# EAGLE schematic LSPSM (EAGLE 6.5.0)

## Sheet 1 of 4
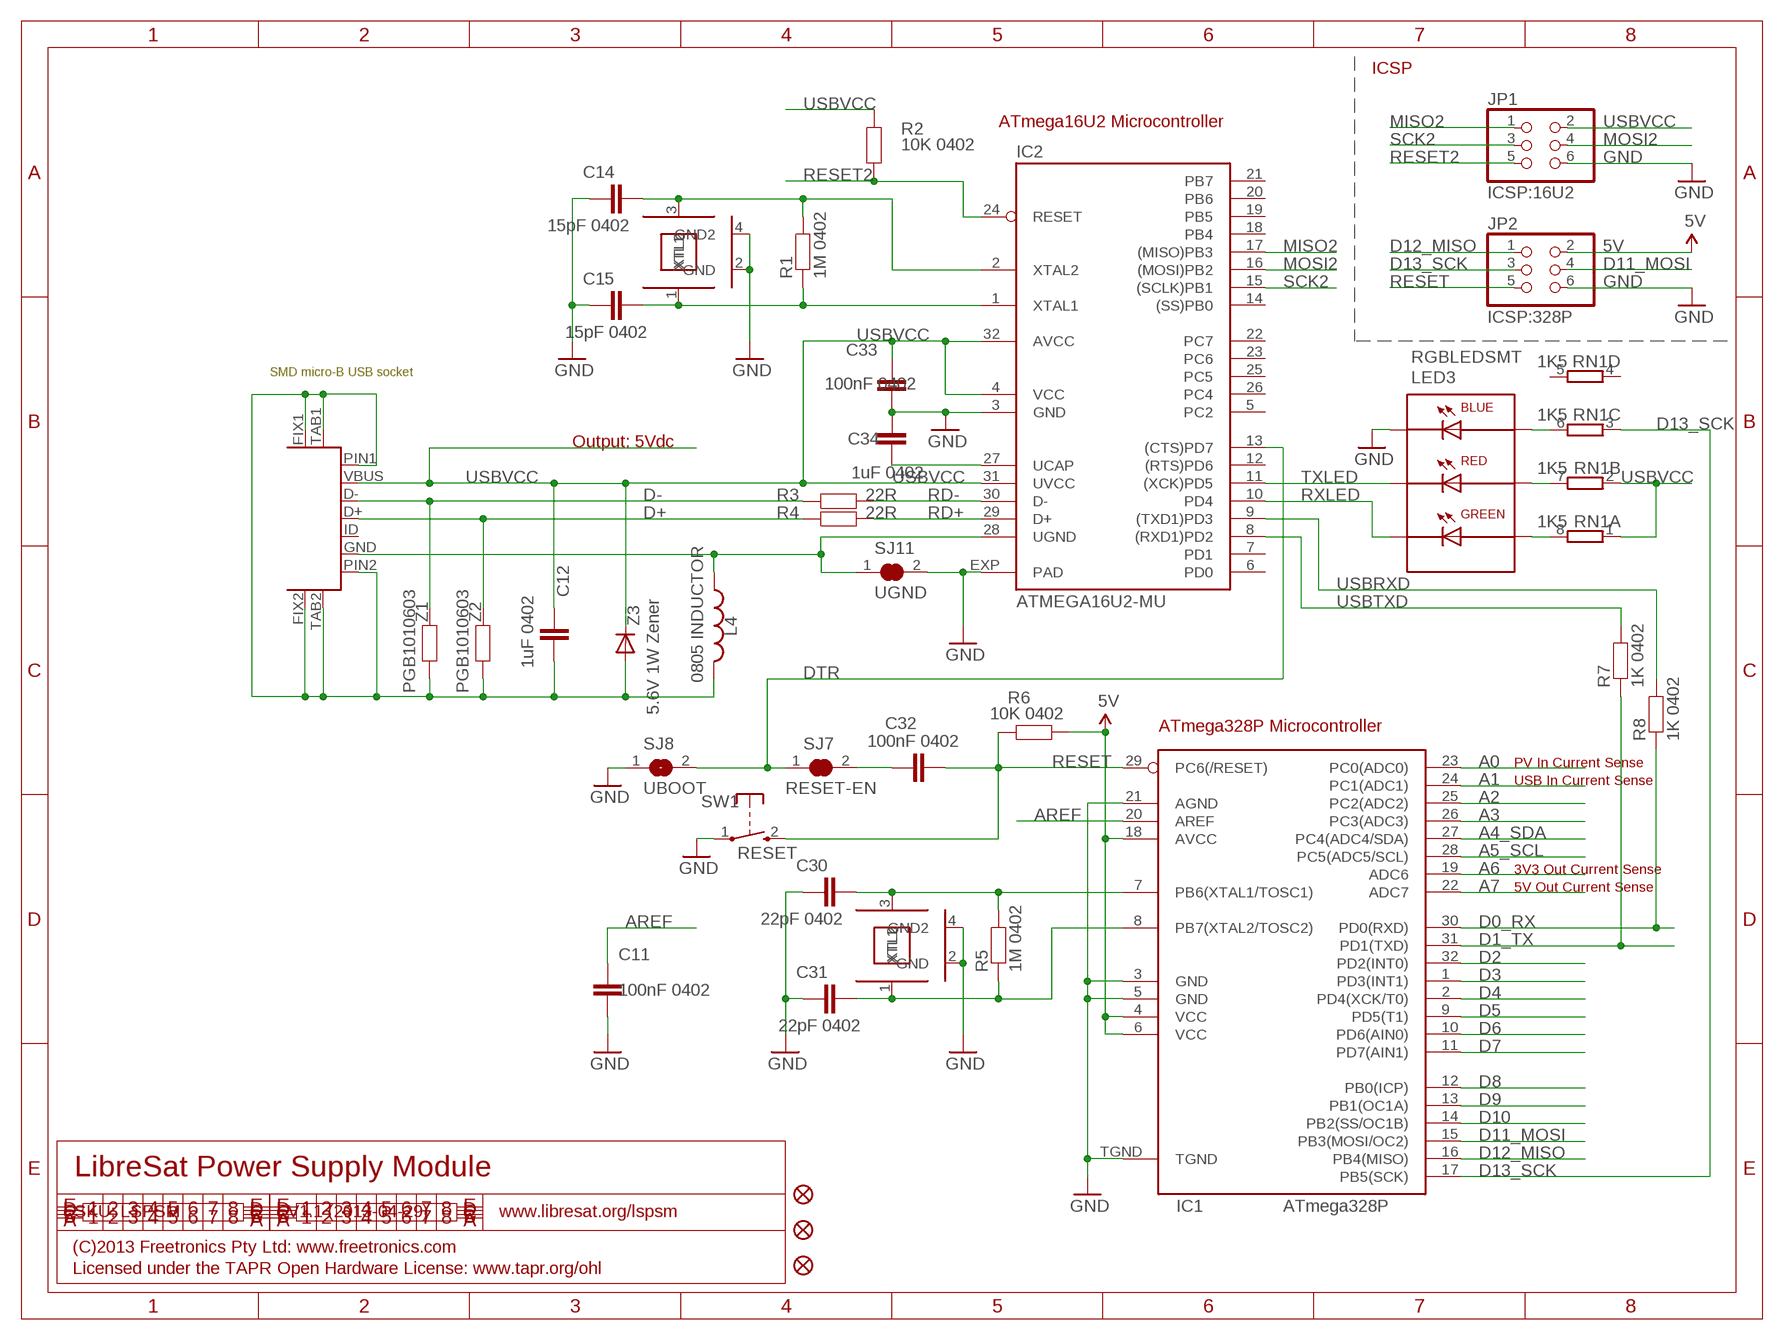
[diagram p0: schematic, sheet 1]

### Parts
C11  100nF 0402  C-EU0402C  [0402C]
C12  1uF 0402  C-EU0402C  [0402C]
C14  15pF 0402  C-EU0402C  [0402C]
C15  15pF 0402  C-EU0402C  [0402C]
C30  22pF 0402  C-EU0402C  [0402C]
C31  22pF 0402  C-EU0402C  [0402C]
C32  100nF 0402  C-EU0402C  [0402C]
C33  100nF 0402  C-EU0402C  [0402C]
C34  1uF 0402  C-EU0402C  [0402C]
FID1  FIDUCIAL1X2.5  [FIDUCIAL-1X2.5]
FID2  FIDUCIAL1X2.5  [FIDUCIAL-1X2.5]
FID3  FIDUCIAL1X2.5  [FIDUCIAL-1X2.5]
IC1  ATmega328P  AVR-MEGA8-MI  [MLF32]
IC2  ATMEGA16U2-MU  ATMEL_ATMEGA8U2-MUQFN  [ATMEL_QFN32]
JP1  ICSP:16U2  PINHD-2X3  [2X03]
JP2  ICSP:328P  PINHD-2X3  [2X03]
L4  0805 INDUCTOR  INDUCTOR0805-LARGE  [0805-LARGE]
LED3  RGBLEDSMT  [19-337]
R1  1M 0402  RESISTOR0402  [0402]
R2  10K 0402  RESISTOR0402  [0402]
R3  22R  RESISTOR0402  [0402]
R4  22R  RESISTOR0402  [0402]
R5  1M 0402  RESISTOR0402  [0402]
R6  10K 0402  RESISTOR0402  [0402]
R7  1K 0402  RESISTOR0402  [0402]
R8  1K 0402  RESISTOR0402  [0402]
RN1  1K5  4R-NCAY16  [CAY16]
S1  USB-6PSMT  [USB-MICROB-MB05PMXX]
SJ7  RESET-EN  SJC0402  [0402SJC]
SJ8  UBOOT  SJ0402O  [0402SJO]
SJ11  UGND  SJC0402  [0402SJC]
SW1  RESET  TAC_SWITCH_2PIN  [TACTILE_SWITCH_SMD_2PIN_TINY]
XTL1  16MHz  CRYSTAL-GND3X2  [CRYSTAL-SMD-3X2]
XTL2  16MHz  CRYSTAL-GND3X2  [CRYSTAL-SMD-3X2]
Z1  PGB1010603  RESISTOR0603  [0603]
Z2  PGB1010603  RESISTOR0603  [0603]
Z3  5.6V 1W Zener  DIODESMA  [SMA-DIODE]

### Nets
5V: IC1.4(VCC) IC1.6(VCC) IC1.18(AVCC) JP2.2 R6.2 ; also sheet 2,4
A0: IC1.23(PC0(ADC0)) ; also sheet 2,3
A1: IC1.24(PC1(ADC1)) ; also sheet 2,3
A2: IC1.25(PC2(ADC2)) ; also sheet 2
A3: IC1.26(PC3(ADC3)) ; also sheet 2
A4_SDA: IC1.27(PC4(ADC4/SDA)) ; also sheet 2
A5_SCL: IC1.28(PC5(ADC5/SCL)) ; also sheet 2
A6: IC1.19(ADC6) ; also sheet 2,4
A7: IC1.22(ADC7) ; also sheet 2,4
AREF: C11.1 IC1.20(AREF) ; also sheet 2
D0_RX: IC1.30(PD0(RXD)) R8.1 ; also sheet 2
D1_TX: IC1.31(PD1(TXD)) R7.1 ; also sheet 2
D2: IC1.32(PD2(INT0)) ; also sheet 2
D3: IC1.1(PD3(INT1)) ; also sheet 2
D4: IC1.2(PD4(XCK/T0)) ; also sheet 2
D5: IC1.9(PD5(T1)) ; also sheet 2
D6: IC1.10(PD6(AIN0)) ; also sheet 2
D7: IC1.11(PD7(AIN1)) ; also sheet 2
D8: IC1.12(PB0(ICP)) ; also sheet 2
D9: IC1.13(PB1(OC1A)) ; also sheet 2
D10: IC1.14(PB2(SS/OC1B)) ; also sheet 2
D11_MOSI: IC1.15(PB3(MOSI/OC2)) JP2.4 ; also sheet 2
D12_MISO: IC1.16(PB4(MISO)) JP2.1 ; also sheet 2
D13_SCK: IC1.17(PB5(SCK)) JP2.3 RN1.3 ; also sheet 2
D+: R4.1 S1.D+ Z2.2
D-: R3.1 S1.D- Z1.2
DTR: IC2.13((CTS)PD7) SJ7.1 SJ8.2
GND: C11.2 C14.1 C15.1 C30.1 C31.1 C33.2 C34.2 IC1.3(GND) IC1.5(GND) IC1.21(AGND) IC1.TGND IC2.3(GND) IC2.EXP(PAD) JP1.6 JP2.6 LED3.1(C-B) SJ8.1 SJ11.2 SW1.1(P) XTL1.2(GND) XTL1.4(GND2) XTL2.2(GND) XTL2.4(GND2) ; also sheet 2,3,4
MISO2: IC2.17((MISO)PB3) JP1.1
MOSI2: IC2.16((MOSI)PB2) JP1.4
N$10: C30.2 IC1.7(PB6(XTAL1/TOSC1)) R5.2 XTL2.3(XTL2)
N$12: C15.2 IC2.1(XTAL1) R1.1 XTL1.1(XTL1)
N$14: LED3.4(A-B) RN1.6
N$16: LED3.5(A-R) RN1.7
N$17: LED3.6(A-G) RN1.8
N$24: C31.2 IC1.8(PB7(XTAL2/TOSC2)) R5.1 XTL2.1(XTL1)
N$34: C34.1 IC2.27(UCAP)
N$38: C12.2 L4.2 S1.FIX1 S1.FIX2 S1.PIN1 S1.PIN2 S1.TAB1 S1.TAB2 Z1.1 Z2.1 Z3.A
N$52: C14.2 IC2.2(XTAL2) R1.2 XTL1.3(XTL2)
N$56: IC2.28(UGND) L4.1 S1.GND SJ11.1
N$60: C32.1 SJ7.2
RD+: IC2.29(D+) R4.2
RD-: IC2.30(D-) R3.2
RESET: C32.2 IC1.29(PC6(/RESET)) JP2.5 R6.1 SW1.2(S) ; also sheet 2
RESET2: IC2.24(RESET) JP1.5 R2.1
RXLED: IC2.10(PD4) LED3.3(C-G)
SCK2: IC2.15((SCLK)PB1) JP1.3
TXLED: IC2.11((XCK)PD5) LED3.2(C-R)
USBRXD: IC2.9((TXD1)PD3) R8.2
USBTXD: IC2.8((RXD1)PD2) R7.2
USBVCC: C12.1 C33.1 IC2.4(VCC) IC2.31(UVCC) IC2.32(AVCC) JP1.2 R2.2 RN1.1 RN1.2 S1.VBUS Z3.C ; also sheet 3
Unconnected: IC2.5(PC2) IC2.6(PD0) IC2.7(PD1) IC2.12((RTS)PD6) IC2.14((SS)PB0) IC2.18(PB4) IC2.19(PB5) IC2.20(PB6) IC2.21(PB7) IC2.22(PC7) IC2.23(PC6) IC2.25(PC5) IC2.26(PC4) RN1.4 RN1.5 S1.ID

### Notes on the sheet
- ICSP
- ATmega16U2 Microcontroller
- SMD micro-B USB socket
- Output: 5Vdc
- ATmega328P Microcontroller
- PV In Current Sense
- USB In Current Sense
- 3V3 Out Current Sense
- 5V Out Current Sense
- LibreSat Power Supply Module
- SKU: LSPSM | V1.1 (2013-04-29) | www.libresat.org/lspsm
- (C)2013 Freetronics Pty Ltd: www.freetronics.com
- Licensed under the TAPR Open Hardware License: www.tapr.org/ohl

## Sheet 2 of 4
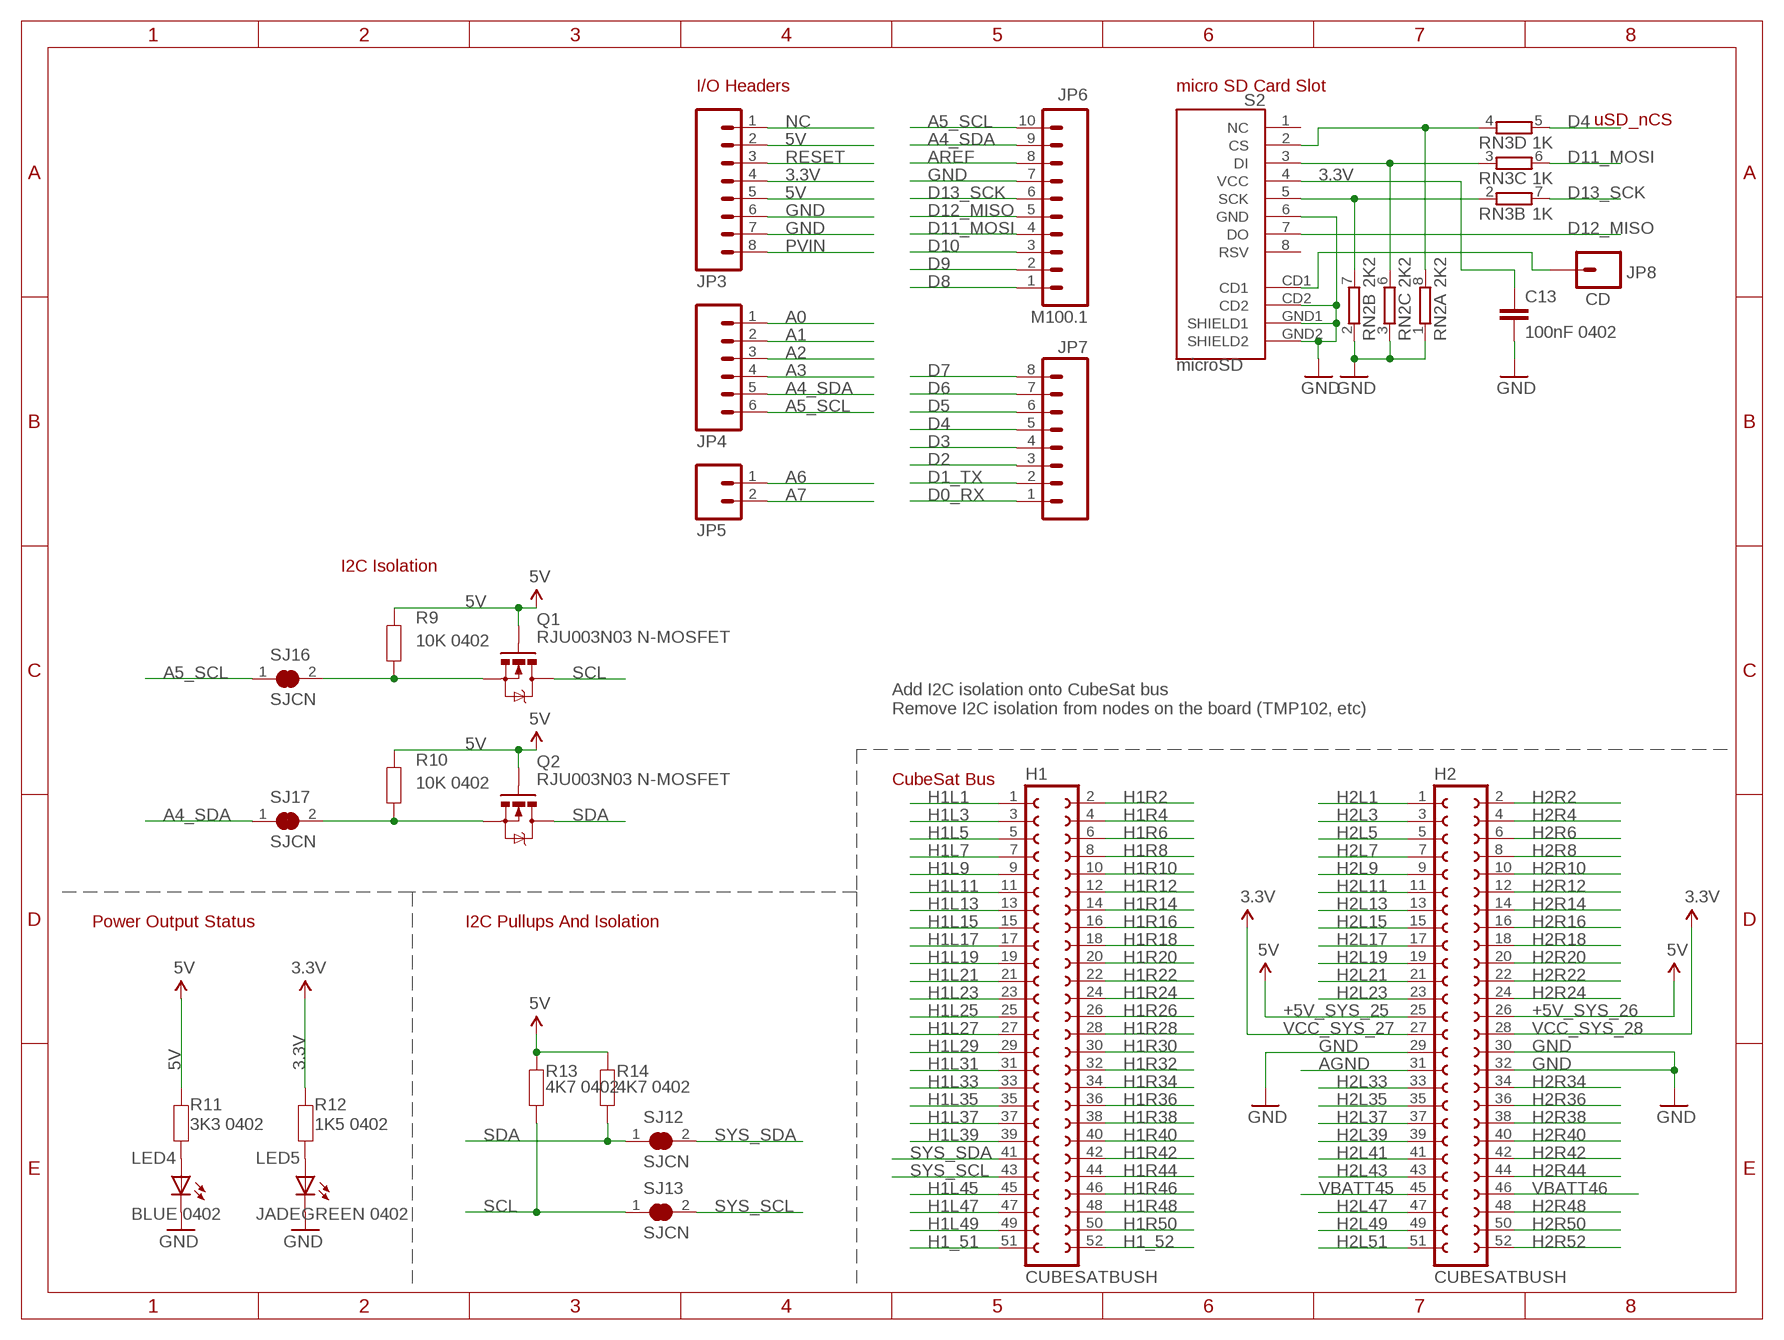
[diagram p1: schematic, sheet 2]

### Parts
C13  100nF 0402  C-EU0402C  [0402C]
H1  CUBESATBUSH  [CUBESATBUS]
H2  CUBESATBUSH  [CUBESATBUS]
JP3  M08  [1X08]
JP4  M06SIP  [1X06]
JP5  M02PTH  [1X02]
JP6  M100.1  [1X10]
JP7  M08  [1X08]
JP8  CD  M01PTH  [1X01]
LED4  BLUE 0402  LED0402  [LED-0402]
LED5  JADEGREEN 0402  LED0402  [LED-0402]
Q1  RJU003N03 N-MOSFET  MOSFET-NSOT-323  [SOT32-3]
Q2  RJU003N03 N-MOSFET  MOSFET-NSOT-323  [SOT32-3]
R9  10K 0402  RESISTOR0402  [0402]
R10  10K 0402  RESISTOR0402  [0402]
R11  3K3 0402  RESISTOR0402  [0402]
R12  1K5 0402  RESISTOR0402  [0402]
R13  4K7 0402  RESISTOR0402  [0402]
R14  4K7 0402  RESISTOR0402  [0402]
RN2  2K2  4R-NCAY16  [CAY16]
RN3  1K  4R-NCAY16  [CAY16]
S2  microSD  USD-SOCKETNEW  [MICRO-SD-SOCKET-PP]
SJ12  SJCN  [SJC]
SJ13  SJCN  [SJC]
SJ16  SJCN  [SJC]
SJ17  SJCN  [SJC]

### Nets
3.3V: C13.1 JP3.4 R12.1 S2.4(VCC) ; also sheet 3,4
5V: JP3.2 JP3.5 Q1.1(G) Q2.1(G) R9.2 R10.2 R11.1 R13.2 R14.2 ; also sheet 1,4
+5V_SYS_25: H2.25 ; supply symbol labelled 5V ; also sheet 4
+5V_SYS_26: H2.26 ; supply symbol labelled 5V ; also sheet 4
A0: JP4.1 ; also sheet 1,3
A1: JP4.2 ; also sheet 1,3
A2: JP4.3 ; also sheet 1
A3: JP4.4 ; also sheet 1
A4_SDA: JP4.5 JP6.9 SJ17.1 ; also sheet 1
A5_SCL: JP4.6 JP6.10 SJ16.1 ; also sheet 1
A6: JP5.1 ; also sheet 1,4
A7: JP5.2 ; also sheet 1,4
AGND: H2.31
AREF: JP6.8 ; also sheet 1
D0_RX: JP7.1 ; also sheet 1
D1_TX: JP7.2 ; also sheet 1
D2: JP7.3 ; also sheet 1
D3: JP7.4 ; also sheet 1
D4: JP7.5 RN3.5 ; also sheet 1
D5: JP7.6 ; also sheet 1
D6: JP7.7 ; also sheet 1
D7: JP7.8 ; also sheet 1
D8: JP6.1 ; also sheet 1
D9: JP6.2 ; also sheet 1
D10: JP6.3 ; also sheet 1
D11_MOSI: JP6.4 RN3.6 ; also sheet 1
D12_MISO: JP6.5 S2.7(DO) ; also sheet 1
D13_SCK: JP6.6 RN3.7 ; also sheet 1
GND: C13.2 H2.29 H2.30 H2.32 JP3.6 JP3.7 JP6.7 LED4.C LED5.C RN2.1 RN2.2 RN2.3 S2.6(GND) S2.CD2 S2.GND1(SHIELD1) S2.GND2(SHIELD2) ; also sheet 1,3,4
H1_51: H1.51
H1_52: H1.52
H1L1: H1.1
H1L3: H1.3
H1L5: H1.5
H1L7: H1.7
H1L9: H1.9
H1L11: H1.11
H1L13: H1.13
H1L15: H1.15
H1L17: H1.17
H1L19: H1.19
H1L21: H1.21
H1L23: H1.23
H1L25: H1.25
H1L27: H1.27
H1L29: H1.29
H1L31: H1.31
H1L33: H1.33
H1L35: H1.35
H1L37: H1.37
H1L39: H1.39
H1L45: H1.45
H1L47: H1.47
H1L49: H1.49
H1R2: H1.2
H1R4: H1.4
H1R6: H1.6
H1R8: H1.8
H1R10: H1.10
H1R12: H1.12
H1R14: H1.14
H1R16: H1.16
H1R18: H1.18
H1R20: H1.20
H1R22: H1.22
H1R24: H1.24
H1R26: H1.26
H1R28: H1.28
H1R30: H1.30
H1R32: H1.32
H1R34: H1.34
H1R36: H1.36
H1R38: H1.38
H1R40: H1.40
H1R42: H1.42
H1R44: H1.44
H1R46: H1.46
H1R48: H1.48
H1R50: H1.50
H2L1: H2.1
H2L3: H2.3
H2L5: H2.5
H2L7: H2.7
H2L9: H2.9
H2L11: H2.11
H2L13: H2.13
H2L15: H2.15
H2L17: H2.17
H2L19: H2.19
H2L21: H2.21
H2L23: H2.23
H2L33: H2.33
H2L35: H2.35
H2L37: H2.37
H2L39: H2.39
H2L41: H2.41
H2L43: H2.43
H2L47: H2.47
H2L49: H2.49
H2L51: H2.51
H2R2: H2.2
H2R4: H2.4
H2R6: H2.6
H2R8: H2.8
H2R10: H2.10
H2R12: H2.12
H2R14: H2.14
H2R16: H2.16
H2R18: H2.18
H2R20: H2.20
H2R22: H2.22
H2R24: H2.24
H2R34: H2.34
H2R36: H2.36
H2R38: H2.38
H2R40: H2.40
H2R42: H2.42
H2R44: H2.44
H2R48: H2.48
H2R50: H2.50
H2R52: H2.52
N$1: LED5.A R12.2
N$6: LED4.A R11.2
N$13: RN2.8 RN3.4 S2.2(CS)
N$46: RN2.6 RN3.3 S2.3(DI)
N$48: RN2.7 RN3.2 S2.5(SCK)
N$50: JP8.1 S2.CD1
N$55: Q1.2(S) R9.1 SJ16.2
N$57: Q2.2(S) R10.1 SJ17.2
NC: JP3.1
PVIN: JP3.8 ; also sheet 3
RESET: JP3.3 ; also sheet 1
SCL: Q1.3(D) R13.1 SJ13.1 ; also sheet 3,4
SDA: Q2.3(D) R14.1 SJ12.1 ; also sheet 3,4
SYS_SCL: H1.43 SJ13.2
SYS_SDA: H1.41 SJ12.2
VBATT45: H2.45 ; also sheet 3
VBATT46: H2.46 ; also sheet 3
VCC_SYS_27: H2.27 ; supply symbol labelled 3.3V ; also sheet 4
VCC_SYS_28: H2.28 ; supply symbol labelled 3.3V ; also sheet 4
Unconnected: RN2.4 RN2.5 RN3.1 RN3.8 S2.1(NC) S2.8(RSV)

### Notes on the sheet
- I/O Headers | micro SD Card Slot
- uSD_nCS
- I2C Isolation
- Add I2C isolation onto CubeSat bus
  Remove I2C isolation from nodes on the board (TMP102, etc)
- CubeSat Bus
- Power Output Status | I2C Pullups And Isolation

## Sheet 3 of 4
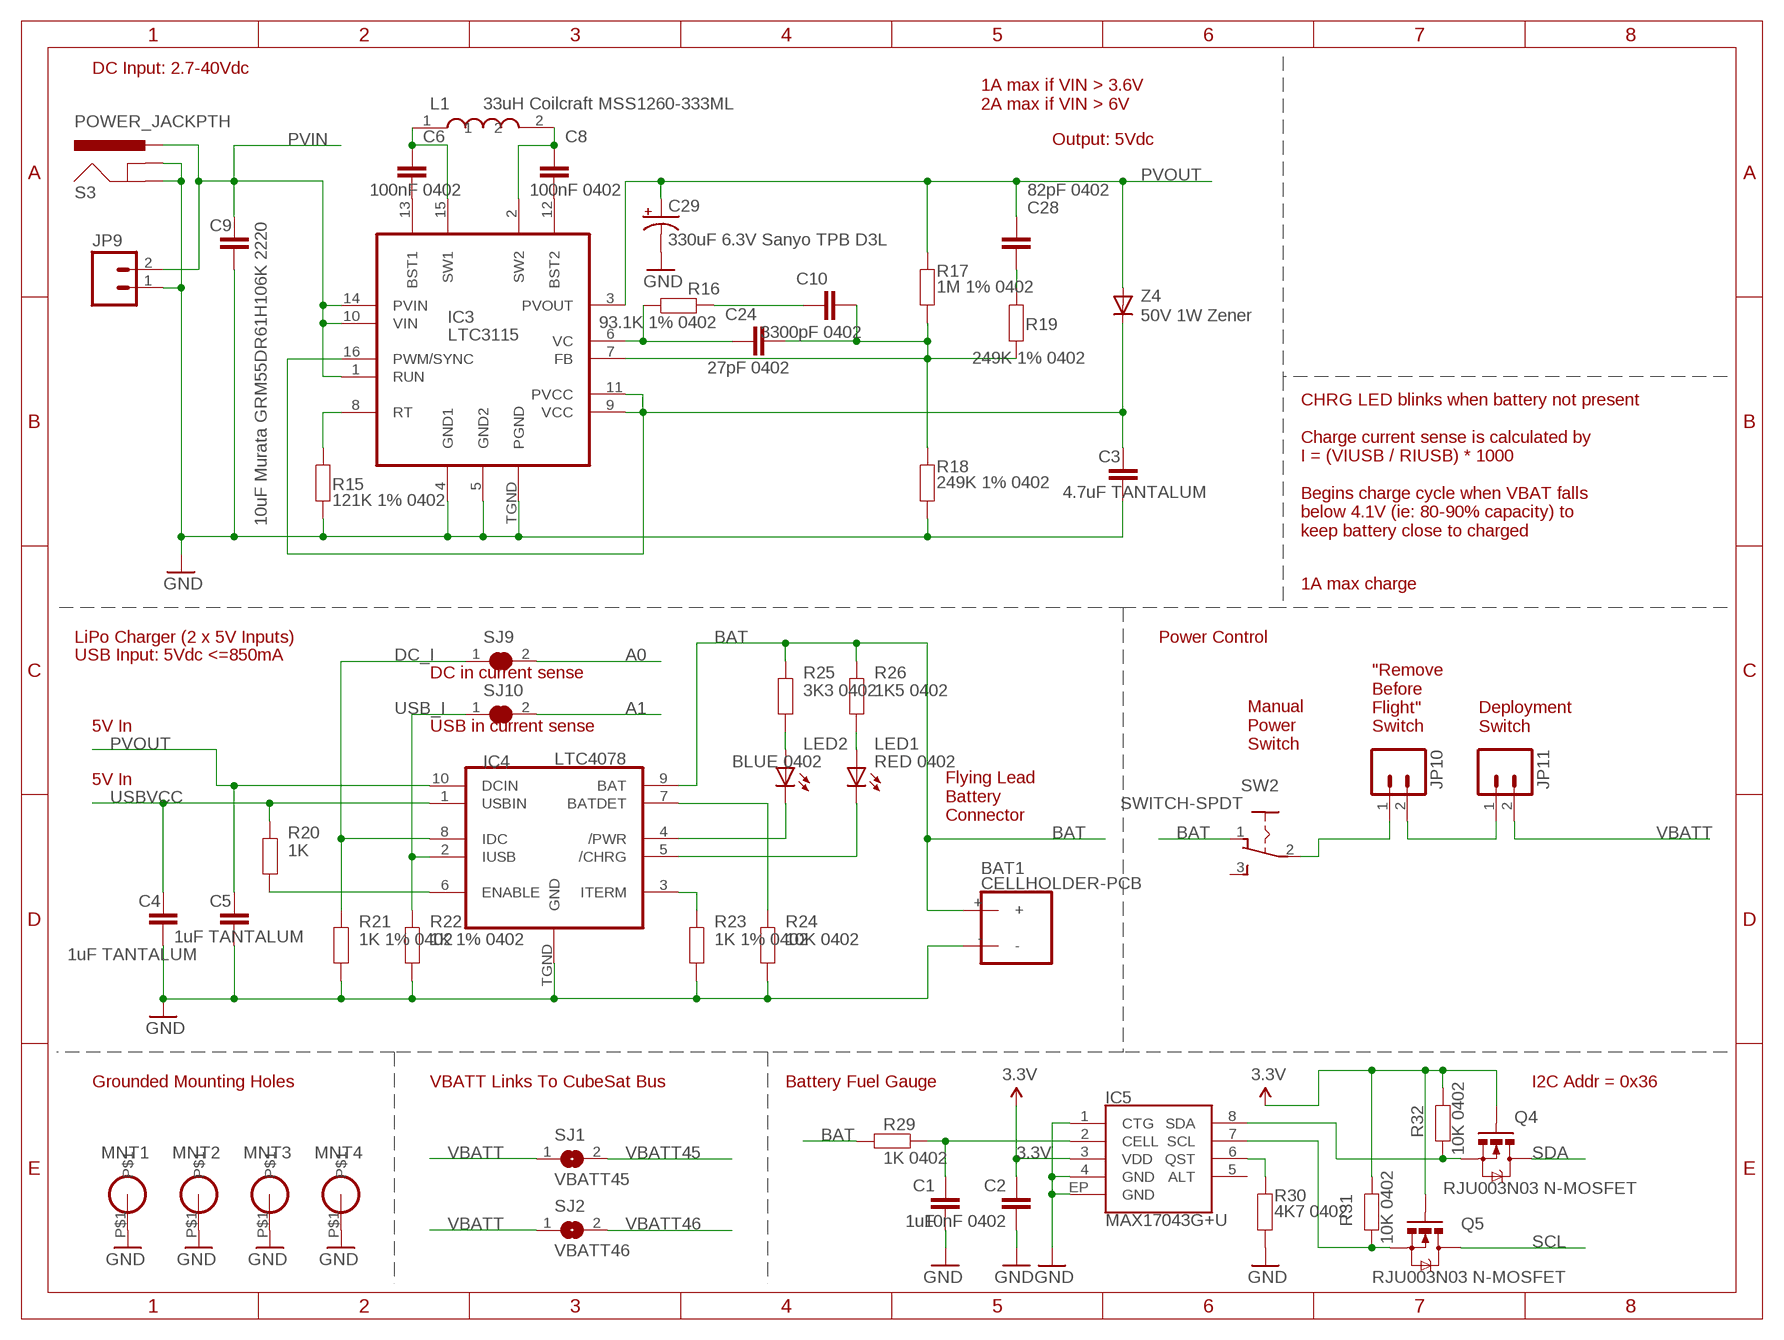
[diagram p2: schematic, sheet 3]

### Parts
BAT1  CELLHOLDER-PCB  [BH-18650-PC]
C1  1uF  C-EU0402C  [0402C]
C2  10nF 0402  C-EU0402C  [0402C]
C3  4.7uF TANTALUM  C-EUC1206K  [C1206K]
C4  1uF TANTALUM  C-EUC1206K  [C1206K]
C5  1uF TANTALUM  C-EUC1206K  [C1206K]
C6  100nF 0402  C-EU0402C  [0402C]
C8  100nF 0402  C-EU0402C  [0402C]
C9  10uF Murata GRM55DR61H106K 2220  C-EUC2220K  [C2220K]
C10  3300pF 0402  C-EU0402C  [0402C]
C24  27pF 0402  C-EU0402C  [0402C]
C28  82pF 0402  C-EU0402C  [0402C]
C29  330uF 6.3V Sanyo TPB D3L  CAP_POLD3L  [D3L]
IC3  LTC3115  [DFN-16]
IC4  LTC4078  [DFN-10]
IC5  MAX17043G+U  MAX1704X  [TDFN-8]
JP9  M02PTH  [1X02]
JP10  M02PTH  [1X02]
JP11  M02PTH  [1X02]
L1  33uH Coilcraft MSS1260-333ML  INDUCTORCDRH  [MSS1260]
LED1  RED 0402  LED0402  [LED-0402]
LED2  BLUE 0402  LED0402  [LED-0402]
MNT1  HOLE3.2MM  [HOLE32]
MNT2  HOLE3.2MM  [HOLE32]
MNT3  HOLE3.2MM  [HOLE32]
MNT4  HOLE3.2MM  [HOLE32]
Q4  RJU003N03 N-MOSFET  MOSFET-NSOT-323  [SOT32-3]
Q5  RJU003N03 N-MOSFET  MOSFET-NSOT-323  [SOT32-3]
R15  121K 1% 0402  RESISTOR0402  [0402]
R16  93.1K 1% 0402  RESISTOR0402  [0402]
R17  1M 1% 0402  RESISTOR0402  [0402]
R18  249K 1% 0402  RESISTOR0402  [0402]
R19  249K 1% 0402  RESISTOR0402  [0402]
R20  1K  RESISTOR0402  [0402]
R21  1K 1% 0402  RESISTOR0402  [0402]
R22  1K 1% 0402  RESISTOR0402  [0402]
R23  1K 1% 0402  RESISTOR0402  [0402]
R24  10K 0402  RESISTOR0402  [0402]
R25  3K3 0402  RESISTOR0402  [0402]
R26  1K5 0402  RESISTOR0402  [0402]
R29  1K 0402  RESISTOR0402  [0402]
R30  4K7 0402  RESISTOR0402  [0402]
R31  10K 0402  RESISTOR0402  [0402]
R32  10K 0402  RESISTOR0402  [0402]
S3  POWER_JACKPTH  [POWER_JACK_PTH]
SJ1  VBATT45  SJ  [SJ]
SJ2  VBATT46  SJ  [SJ]
SJ9  DC_I  SJCN  [SJC]
SJ10  USB_I  SJCN  [SJC]
SW2  SWITCH-SPDT  [SS-12F100]
Z4  50V 1W Zener  DIODESMA  [SMA-DIODE]

### Nets
3.3V: C2.1 IC5.3(VDD) Q4.1(G) Q5.1(G) R31.2 R32.2 ; also sheet 2,4
A0: SJ9.2 ; also sheet 1,2
A1: SJ10.2 ; also sheet 1,2
BAT: BAT1.+ IC4.9(BAT) R25.1 R26.1 R29.2 SW2.1
CELL: C1.1 IC5.2(CELL) R29.1
DC_I: IC4.8(IDC) R21.1 SJ9.1
GND: BAT1.- C1.2 C2.2 C3.1 C4.1 C5.1 C9.1 C29.NEG(-) IC3.4(GND1) IC3.5(GND2) IC3.TGND(PGND) IC4.TGND(GND) IC5.1(CTG) IC5.4(GND) IC5.EP(GND) JP9.1 MNT1.P$1 MNT2.P$1 MNT3.P$1 MNT4.P$1 R15.1 R18.1 R21.2 R22.2 R23.2 R24.2 R30.1 S3.GND S3.GNDBREAK ; also sheet 1,2,4
N$2: JP10.2 JP11.1
N$3: LED2.A R25.2
N$5: JP10.1 SW2.2
N$8: IC5.8(SDA) Q4.2(S) R32.1
N$9: IC5.7(SCL) Q5.2(S) R31.1
N$20: IC4.7(BATDET) R24.1
N$27: IC4.4(/PWR) LED2.C
N$35: IC4.3(ITERM) R23.1
N$36: IC4.6(ENABLE) R20.2
N$37: C10.1 R16.2
N$39: C3.2 IC3.9(VCC) IC3.11(PVCC) IC3.16(PWM/SYNC) Z4.C
N$40: C6.2 IC3.13(BST1)
N$41: C8.2 IC3.12(BST2)
N$42: C6.1 IC3.15(SW1) L1.1
N$43: C8.1 IC3.2(SW2) L1.2
N$44: C24.1 IC3.6(VC) R16.1
N$45: C10.2 C24.2 IC3.7(FB) R17.1 R18.2 R19.1
N$47: IC3.8(RT) R15.2
N$49: C28.2 R19.2
N$248: LED1.A R26.2
N$251: IC4.5(/CHRG) LED1.C
PVIN: C9.2 IC3.1(RUN) IC3.10(VIN) IC3.14(PVIN) JP9.2 S3.PWR ; also sheet 2
PVOUT: C5.2 C28.1 C29.POS(+) IC3.3(PVOUT) IC4.10(DCIN) R17.2 Z4.A
QST: IC5.6(QST) R30.2
SCL: Q5.3(D) ; also sheet 2,4
SDA: Q4.3(D) ; also sheet 2,4
USB_I: IC4.2(IUSB) R22.1 SJ10.1
USBVCC: C4.2 IC4.1(USBIN) R20.1 ; also sheet 1
VBATT: JP11.2 SJ1.1 SJ2.1 ; also sheet 4
VBATT45: SJ1.2 ; also sheet 2
VBATT46: SJ2.2 ; also sheet 2
Unconnected: IC5.5(ALT) SW2.3

### Notes on the sheet
- DC Input: 2.7-40Vdc
- 1A max if VIN > 3.6V
  2A max if VIN > 6V
- Output: 5Vdc
- CHRG LED blinks when battery not present
  
  Charge current sense is calculated by
  I = (VIUSB / RIUSB) * 1000
  
  Begins charge cycle when VBAT falls
  below 4.1V (ie: 80-90% capacity) to
  keep battery close to charged
- 1A max charge
- LiPo Charger (2 x 5V Inputs) | Power Control
- USB Input: 5Vdc <=850mA
- DC in current sense
- 5V In | USB in current sense
- "Remove
  Before
  Flight"
  Switch
- Deployment
  Switch
- Manual
  Power
  Switch
- 5V In
- Flying Lead
  Battery
  Connector
- Grounded Mounting Holes | VBATT Links To CubeSat Bus | Battery Fuel Gauge | I2C Addr = 0x36

## Sheet 4 of 4
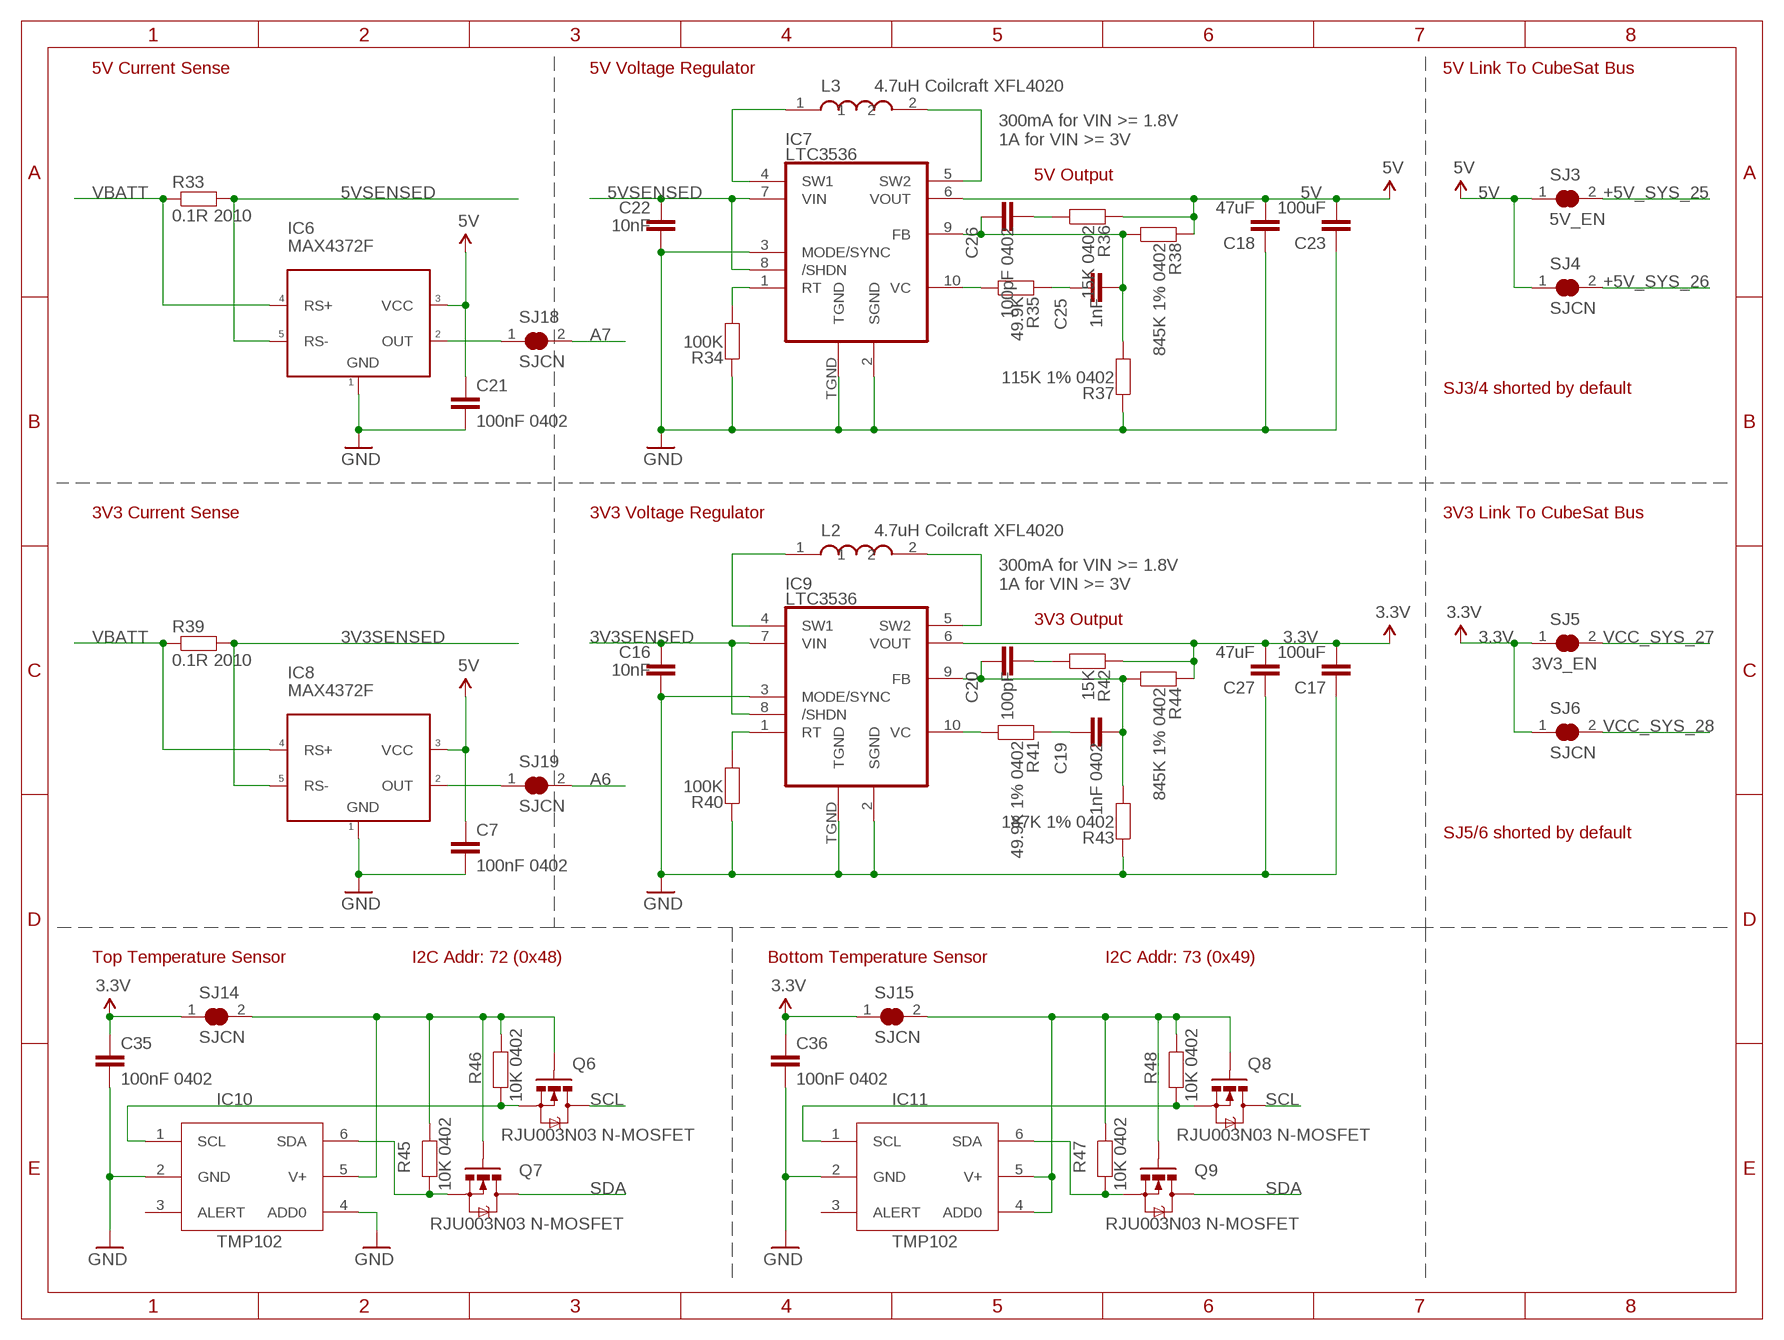
[diagram p3: schematic, sheet 4]

### Parts
C7  100nF 0402  C-EU0402C  [0402C]
C16  10nF  C-EU0402C  [0402C]
C17  100uF  C-EUC1206K  [C1206K]
C18  47uF  C-EUC1206K  [C1206K]
C19  1nF 0402  C-EU0402C  [0402C]
C20  100pF  C-EU0402C  [0402C]
C21  100nF 0402  C-EU0402C  [0402C]
C22  10nF  C-EU0402C  [0402C]
C23  100uF  C-EUC1206K  [C1206K]
C25  1nF  C-EU0402C  [0402C]
C26  100pF 0402  C-EU0402C  [0402C]
C27  47uF  C-EUC1206K  [C1206K]
C35  100nF 0402  C-EU0402C  [0402C]
C36  100nF 0402  C-EU0402C  [0402C]
IC6  MAX4372F  MAX4372  [SOT23-5]
IC7  LTC3536  [DFN-10]
IC8  MAX4372F  MAX4372  [SOT23-5]
IC9  LTC3536  [DFN-10]
IC10  TMP102  [SOT563]
IC11  TMP102  [SOT563]
L2  4.7uH Coilcraft XFL4020  INDUCTOR  [XFL4020]
L3  4.7uH Coilcraft XFL4020  INDUCTOR  [XFL4020]
Q6  RJU003N03 N-MOSFET  MOSFET-NSOT-323  [SOT32-3]
Q7  RJU003N03 N-MOSFET  MOSFET-NSOT-323  [SOT32-3]
Q8  RJU003N03 N-MOSFET  MOSFET-NSOT-323  [SOT32-3]
Q9  RJU003N03 N-MOSFET  MOSFET-NSOT-323  [SOT32-3]
R33  0.1R 2010  RESISTOR2010  [R2010]
R34  100K  RESISTOR0402  [0402]
R35  49.9K  RESISTOR0402  [0402]
R36  15K 0402  RESISTOR0402  [0402]
R37  115K 1% 0402  RESISTOR0402  [0402]
R38  845K 1% 0402  RESISTOR0402  [0402]
R39  0.1R 2010  RESISTOR2010  [R2010]
R40  100K  RESISTOR0402  [0402]
R41  49.9K 1% 0402  RESISTOR0402  [0402]
R42  15K  RESISTOR0402  [0402]
R43  187K 1% 0402  RESISTOR0402  [0402]
R44  845K 1% 0402  RESISTOR0402  [0402]
R45  10K 0402  RESISTOR0402  [0402]
R46  10K 0402  RESISTOR0402  [0402]
R47  10K 0402  RESISTOR0402  [0402]
R48  10K 0402  RESISTOR0402  [0402]
SJ3  5V_EN  SJCN  [SJC]
SJ4  SJCN  [SJC]
SJ5  3V3_EN  SJCN  [SJC]
SJ6  SJCN  [SJC]
SJ14  SJCN  [SJC]
SJ15  SJCN  [SJC]
SJ18  SJCN  [SJC]
SJ19  SJCN  [SJC]

### Nets
3.3V: C17.2 C27.2 C35.1 C36.1 IC9.6(VOUT) R42.2 R44.2 SJ5.1 SJ6.1 SJ14.1 SJ15.1 ; also sheet 2,3
3V3SENSED: C16.1 IC8.5(RS-) IC9.7(VIN) IC9.8(/SHDN) R39.2
5V: C7.1 C18.2 C21.1 C23.2 IC6.3(VCC) IC7.6(VOUT) IC8.3(VCC) R36.2 R38.2 SJ3.1 SJ4.1 ; also sheet 1,2
5VSENSED: C22.1 IC6.5(RS-) IC7.7(VIN) IC7.8(/SHDN) R33.2
+5V_SYS_25: SJ3.2 ; also sheet 2
+5V_SYS_26: SJ4.2 ; also sheet 2
A6: SJ19.2 ; also sheet 1,2
A7: SJ18.2 ; also sheet 1,2
GND: C7.2 C16.2 C17.1 C18.1 C21.2 C22.2 C23.1 C27.1 C35.2 C36.2 IC6.1(GND) IC7.2(SGND) IC7.3(MODE/SYNC) IC7.TGND IC8.1(GND) IC9.2(SGND) IC9.3(MODE/SYNC) IC9.TGND IC10.2(GND) IC10.4(ADD0) IC11.2(GND) R34.2 R37.2 R40.2 R43.2 ; also sheet 1,2,3
N$11: IC6.2(OUT) SJ18.1
N$15: IC9.10(VC) R41.1
N$18: IC9.4(SW1) L2.1
N$19: IC9.5(SW2) L2.2
N$21: IC9.1(RT) R40.1
N$22: IC7.4(SW1) L3.1
N$23: C19.1 R41.2
N$25: C20.2 R42.1
N$26: C19.2 C20.1 IC9.9(FB) R43.1 R44.1
N$28: IC7.5(SW2) L3.2
N$29: IC7.1(RT) R34.1
N$30: C25.1 R35.2
N$31: IC7.10(VC) R35.1
N$32: C26.2 R36.1
N$33: C25.2 C26.1 IC7.9(FB) R37.1 R38.1
N$51: IC8.2(OUT) SJ19.1
N$53: IC10.5(V+) Q6.1(G) Q7.1(G) R45.2 R46.2 SJ14.2
N$54: IC11.4(ADD0) IC11.5(V+) Q8.1(G) Q9.1(G) R47.2 R48.2 SJ15.2
N$9999: IC10.1(SCL) Q6.2(S) R46.1
N$10001: IC10.6(SDA) Q7.2(S) R45.1
N$10002: IC11.6(SDA) Q9.2(S) R47.1
N$10003: IC11.1(SCL) Q8.2(S) R48.1
SCL: Q6.3(D) Q8.3(D) ; also sheet 2,3
SDA: Q7.3(D) Q9.3(D) ; also sheet 2,3
VBATT: IC6.4(RS+) IC8.4(RS+) R33.1 R39.1 ; also sheet 3
VCC_SYS_27: SJ5.2 ; also sheet 2
VCC_SYS_28: SJ6.2 ; also sheet 2
Unconnected: IC10.3(ALERT) IC11.3(ALERT)

### Notes on the sheet
- 5V Current Sense | 5V Voltage Regulator | 5V Link To CubeSat Bus
- 300mA for VIN >= 1.8V
  1A for VIN >= 3V
- 5V Output
- SJ3/4 shorted by default
- 3V3 Current Sense | 3V3 Voltage Regulator | 3V3 Link To CubeSat Bus
- 300mA for VIN >= 1.8V
  1A for VIN >= 3V
- 3V3 Output
- SJ5/6 shorted by default
- Top Temperature Sensor | I2C Addr: 72 (0x48) | Bottom Temperature Sensor | I2C Addr: 73 (0x49)

## Library data of the parts
BAT1 = freetronics-jon:CELLHOLDER-PCB
C1-C28 C30-C36 = freetronics-jon:C-EU: CAPACITOR, European symbol
C29 = freetronics-jon:CAP_POL: Capacitor Polarized These are standard SMD and PTH capacitors. Normally 10uF, 47uF, and 100uF in electrolytic and tantalum varieties. Always verify the external diameter of the through hole cap, it varies with capacity, voltage, and manufacturer. The EIA devices should be standard.
FID1-FID3 = freetronics-original:FIDUCIAL: Fiducial Alignment Points Various fiducial points for machine vision alignment.
H1 H2 = freetronics-jon:CUBESATBUS
IC1 = freetronics-jon:AVR-MEGA8: MICROCONTROLLER 8 Kbytes FLASH 1 kbytes SRAM 512 bytes EEPROM USART 6-channel 10 bit ADC 2-channel 8 bit ADC
IC2 = freetronics-jon:ATMEL_ATMEGA8U2-MU
IC3 = freetronics-jon:LTC3115
IC4 = freetronics-jon:LTC4078
IC5 = SparkFun:MAX1704X: MAX17043/MAX17044: Battery Fuel Guage (43 is 1cell, 44 is 2cell)
IC6 IC8 = freetronics-jon:MAX4372
IC7 IC9 = freetronics-jon:LTC3536
IC10 IC11 = freetronics-jon:TMP102
JP1 JP2 = pinhead:PINHD-2X3: PIN HEADER
JP3 JP7 = freetronics-marc:M08: Header 8 Standard 8-pin 0.1" header. Use with straight break away headers (SKU : PRT-00116), right angle break away headers (PRT-00553), swiss pins (PRT-00743), machine pins (PRT-00117), and female headers (PRT-00115).
JP4 = freetronics-marc:M06: Header 6 Standard 6-pin 0.1" header. Use with straight break away headers (SKU : PRT-00116), right angle break away headers (PRT-00553), swiss pins (PRT-00743), machine pins (PRT-00117), and female headers (PRT-00115). Molex polarized connector foot print use with SKU : PRT-08094 with associated crimp pins and housings. NOTES ON THE VARIANTS LOCK and LOCK_LONGPADS... This footprint was designed to help hold the alignment of a through-hole component (i.e. 6-pin header) while soldering it into place. You may notice that each hole has been shifted either up or down by 0.005 of an inch from it's more standard position (which is a perfectly straight line). This slight alteration caused the pins (the squares in the middle) to touch the edges of the holes. Because they are alternating, it causes a "brace" to hold the component in place. 0.005 has proven to be the perfect amount of "off-center" position when using our standard breakaway headers. Although looks a little odd when you look at the bare footprint, once you have a header in there, the alteration is very hard to notice. Also, if you push a header all the way into place, it is covered up entirely on the bottom side. This idea of altering the position of holes to aid alignment will be further integrated into the Sparkfun Library for other footprints. It can help hold any component with 3 or more connection pins.
JP5 = freetronics-marc:M02: Header 2 Standard 2-pin 0.1" header. Use with straight break away headers (SKU : PRT-00116), right angle break away headers (PRT-00553), swiss pins (PRT-00743), machine pins (PRT-00117), and female headers (PRT-00115). Molex polarized connector foot print use with SKU : PRT-08233 with associated crimp pins and housings.
JP6 = freetronics-marc:M10: Header 10 Standard 10-pin 0.1" header. Use with straight break away headers (SKU : PRT-00116), right angle break away headers (PRT-00553), swiss pins (PRT-00743), machine pins (PRT-00117), and female headers (PRT-00115).
JP8 = freetronics-2:M01: Header 1 Standard 1-pin 0.1" header. Use with straight break away headers (SKU : PRT-00116), right angle break away headers (PRT-00553), swiss pins (PRT-00743), machine pins (PRT-00117), and female headers (PRT-00115).
JP9-JP11 = freetronics-master-v1:M02: Header 2 Standard 2-pin 0.1" header. Use with straight break away headers (SKU : PRT-00116), right angle break away headers (PRT-00553), swiss pins (PRT-00743), machine pins (PRT-00117), and female headers (PRT-00115). Molex polarized connector foot print use with SKU : PRT-08233 with associated crimp pins and housings.
L1-L3 = freetronics-jon:INDUCTOR
L4 = freetronics-master-v1.1:INDUCTOR: Inductors Basic Inductor/Choke - 0603 and 1206. Footprints are not proven and vary greatly between part numbers.
LED1 LED2 LED4 LED5 = freetronics-jon:LED: LEDs Standard schematic elements and footprints for 5mm, 3mm, 1206, and 0603 sized LEDs. 5mm - Spark Fun Electronics SKU : COM-00529 (and others)
LED3 = freetronics-master-v1:RGBLED
MNT1-MNT4 = freetronics-jon:HOLE
Q1 Q2 Q4-Q9 = freetronics-jon:MOSFET-N: Basic N-Channel MOSFET
R1-R26 R29-R32 R34-R38 R40-R48 = freetronics-jon:RESISTOR: Resistor Basic schematic elements and footprints for 0603, 1206, and PTH 1/10th watt (small) resistors.
R33 R39 = freetronics-original:RESISTOR: Resistor Basic schematic elements and footprints for 0603, 1206, and PTH 1/10th watt (small) resistors.
RN1 = resistor-dil:4R-N: Array Chip Resistor Source: RS Component / Phycomp
RN2 RN3 = freetronics-master-v1:4R-N: Array Chip Resistor Source: RS Component / Phycomp
S1 = freetronics-jon:USB-6P
S2 = freetronics-master-v1:USD-SOCKET: microSD Socket Push-push type uSD socket. Schematic element and footprint production proven. Spark Fun Electronics SKU : PRT-00127. tDoc lines correctly indicate media card edge positions when inserting (unlocked, locked, depressed).
S3 = freetronics-master-v1:POWER_JACK: Power Jack This is the standard 5.5mm barrel jack for power. The PTH is the most common, proven, reliable, footprint. All others are experimental. The Slot footprint only works if the mill layer is transmitted to the PCB fab house so be warned. Spark Fun Electronics SKU : PRT-00119. Mating wall wart : TOL-00298 (and others)
SJ1 SJ2 = freetronics-master-v1.1:SJ: SMD solder JUMPER
SJ3-SJ7 SJ9-SJ19 = freetronics-jon:SJC
SJ8 = freetronics-jon:SJ: SMD solder JUMPER
SW1 = freetronics-master-v1:TAC_SWITCH_2PIN: Momentary Tactile Switch - 2 pin
SW2 = freetronics-jon:SWITCH-SPDT
XTL1 XTL2 = freetronics-jon:CRYSTAL-GND
Z1 Z2 = freetronics-master-v1.1:RESISTOR: Resistor Basic schematic elements and footprints for 0603, 1206, and PTH 1/10th watt (small) resistors.
Z3 Z4 = freetronics-master-v1:DIODE: Diode These are standard reverse protection diodes and small signal diodes. SMA package can handle up to about 1A. SOD-323 can handle about 200mA. What the SOD-323 package when ordering, there are some mfgs out there that are 5-pin packages.

## Net classes
0 default: width 0.152 mm, drill 0.241 mm, clearance 0.152 mm